# EAGLE design MicroMod-LoRa-1W-Function-Board-Waterfall (EAGLE 9.6.2)
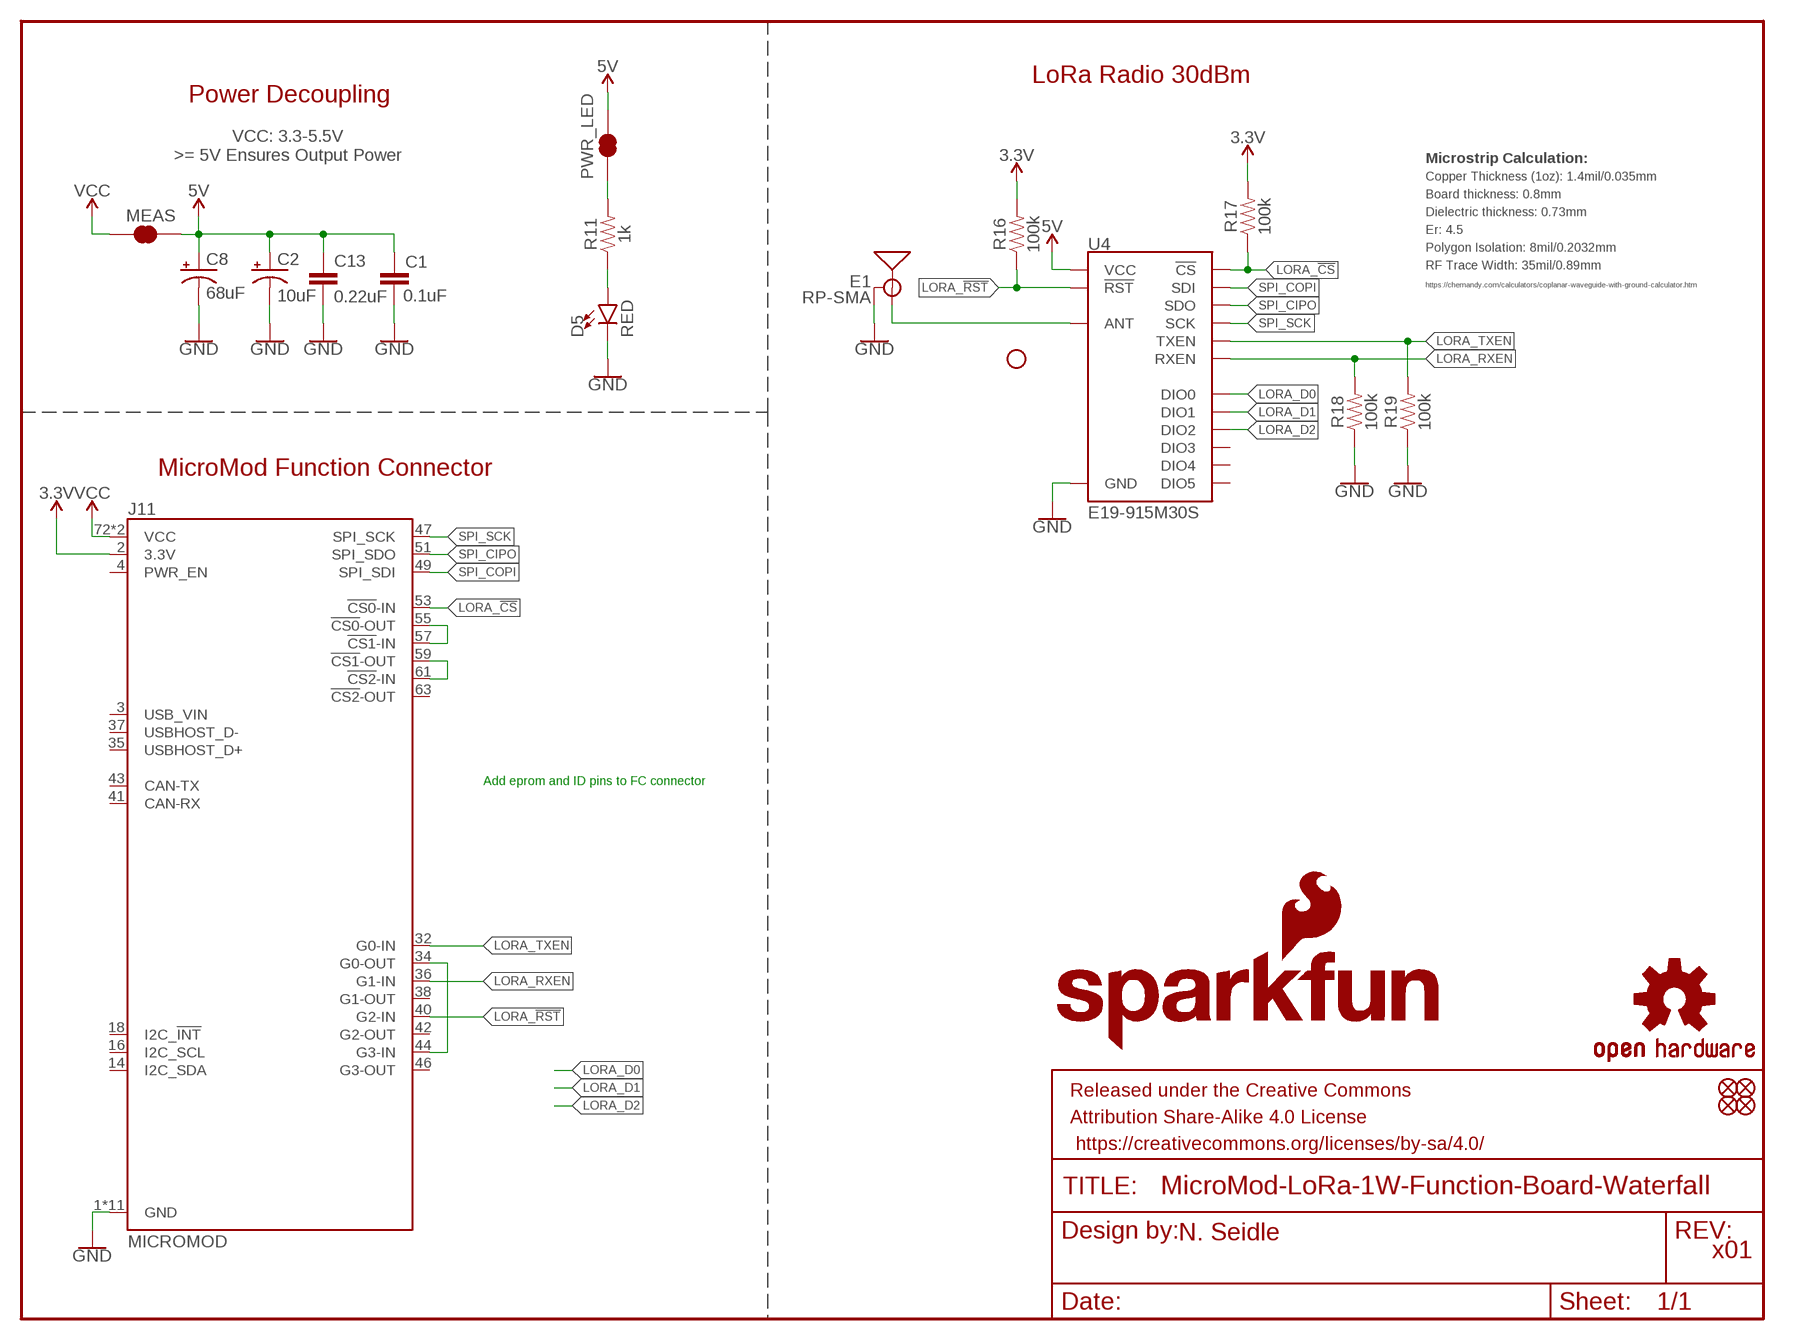
[diagram p0: schematic, sheet 1]

## Parts
C1  0.1uF  0.1UF-0603-25V-(+80/-20%)  [0603]
C2  10uF  10UF-POLAR-EIA3216-16V-10%(TANT)  [EIA3216]
C8  68uF  68UF-POLAR-EIA3528-10V-10%(TANT)  [EIA3528]
C13  0.22uF  0.22UF-0603-25V-10%  [0603]
D5  RED  LED-RED0603  [LED-0603]
E1  RP-SMA  ANTENNA-SMA-GROUNDEDEDGE_RPSMA_SMD  [SMA-EDGE-SMD]
FD1  FIDUCIALUFIDUCIAL  [FIDUCIAL-MICRO]
FD2  FIDUCIALUFIDUCIAL  [FIDUCIAL-MICRO]
FD3  FIDUCIALUFIDUCIAL  [FIDUCIAL-MICRO]
FD4  FIDUCIALUFIDUCIAL  [FIDUCIAL-MICRO]
FRAME2  FRAME-LETTER  [CREATIVE_COMMONS]
H1  STAND-OFF  [STAND-OFF]
J11  MICROMOD  [M.2-CARD-E-22_FUNCTION_STANDARD]
LOGO1  SFE_LOGO_NAME_FLAME.1_INCH  [SFE_LOGO_NAME_FLAME_.1]
LOGO3  OSHW-LOGOMINI  [OSHW-LOGO-MINI]
MEAS  JUMPER-COMBO_2_NC_TRACE  [COMBO-JUMPER_2_NC_TRACE]
PWR_LED  JUMPER-SMT_2_NC_TRACE_SILK  [SMT-JUMPER_2_NC_TRACE_SILK]
R11  1k  1KOHM-0603-1/10W-1%  [0603]
R16  100k  100KOHM-0603-1/10W-1%  [0603]
R17  100k  100KOHM-0603-1/10W-1%  [0603]
R18  100k  100KOHM-0603-1/10W-1%  [0603]
R19  100k  100KOHM-0603-1/10W-1%  [0603]
U4  E19-915M30S  E19-915MS1W  [E19-915MS1W]

## Nets
3.3V: J11.2(3.3V) R16.2 R17.2
5V: C1.1 C2.+ C8.A(+) C13.1 MEAS.2 MEAS.4 PWR_LED.2 U4.11(VCC)
GND: C1.2 C2.- C8.C(-) C13.2 D5.C E1.GND@0(GND) E1.GND@1(GND) J11.1(GND) J11.33(GND) J11.39(GND) J11.45(GND) J11.75(GND) J11.GND1(GND) J11.GND2(GND) J11.GND3(GND) J11.GND4(GND) J11.GND5(GND) J11.GND6(GND) R18.1 R19.1 U4.1(GND) U4.9(GND) U4.10(GND) U4.18(GND) U4.20(GND) U4.21(GND) U4.22(GND)
LORA_!CS!: J11.53(!CS0!-IN) R17.1 U4.15(!CS)
LORA_!RST!: J11.40(G2-IN) R16.1 U4.8(!RST)
LORA_D0: U4.7(DIO0)
LORA_D1: U4.6(DIO1)
LORA_D2: U4.5(DIO2)
LORA_RXEN: J11.36(G1-IN) R18.2 U4.17(RXEN)
LORA_TXEN: J11.32(G0-IN) R19.2 U4.16(TXEN)
N$1: E1.SIG(SIGNAL) U4.19(ANT)
N$2: J11.55(!CS0!-OUT) J11.57(!CS1!-IN)
N$3: J11.59(!CS1!-OUT) J11.61(!CS2!-IN)
N$4: J11.34(G0-OUT) J11.44(G3-IN)
N$5: D5.A R11.1
N$6: PWR_LED.1 R11.2
SPI_CIPO: J11.51(SPI_SDO) U4.13(SDO)
SPI_COPI: J11.49(SPI_SDI) U4.14(SDI)
SPI_SCK: J11.47(SPI_SCK) U4.12(SCK)
VCC: J11.72(VCC) J11.74(VCC) MEAS.1 MEAS.3
Unconnected: J11.3(USB_VIN) J11.4(PWR_EN) J11.14(I2C_SDA) J11.16(I2C_SCL) J11.18(I2C_!INT!) J11.35(USBHOST_D+) J11.37(USBHOST_D-) J11.38(G1-OUT) J11.41(CAN-RX) J11.42(G2-OUT) J11.43(CAN-TX) J11.46(G3-OUT) J11.63(!CS2!-OUT) U4.2(DIO5) U4.3(DIO4) U4.4(DIO3)

## Notes on the sheet
- LoRa Radio 30dBm
- Power Decoupling
- VCC: 3.3-5.5V
  >= 5V Ensures Output Power
- Microstrip Calculation:
- Copper Thickness (1oz): 1.4mil/0.035mm
- Board thickness: 0.8mm
- Dielectric thickness: 0.73mm
- Er: 4.5
- Polygon Isolation: 8mil/0.2032mm
- RF Trace Width: 35mil/0.89mm
- https://chemandy.com/calculators/coplanar-waveguide-with-ground-calculator.htm
- MicroMod Function Connector
- Add eprom and ID pins to FC connector
- N. Seidle
- x01

## Library data of the parts
C1 = SparkFun-Capacitors:0.1UF: 0.1µF ceramic capacitors A capacitor is a passive two-terminal electrical component used to store electrical energy temporarily in an electric field.; PROD_ID: CAP-00810
C2 = SparkFun-Capacitors:10UF-POLAR: 10.0µF polarized capacitors A capacitor is a passive two-terminal electrical component used to store electrical energy temporarily in an electric field.; PROD_ID: CAP-00811
C8 = SparkFun-Capacitors:68UF-POLAR: 68µF polarized capacitors A capacitor is a passive two-terminal electrical component used to store electrical energy temporarily in an electric field.; PROD_ID: CAP-10790
C13 = SparkFun-Capacitors:0.22UF: 0.22µF ceramic capacitors A capacitor is a passive two-terminal electrical component used to store electrical energy temporarily in an electric field.; PROD_ID: CAP-07822
D5 = SparkFun-LED:LED-RED: Red SMD LED Used in manufacturing of most products at SparkFun Packages: 0603 - SMD 0603 package [Product Link] <http://docs.avagotech.com/docs/AV02-0551EN> 0603 SMART - SMD 0603 SMART package ( more efficient and expensive)[Product Link] <http://www.osram-os.com/Graphics/XPic2/00077099_0.pdf> 1206 - SMD1206 package [Product Link] <https://www.sparkfun.com/datasheets/DevTools/LilyPad/Q150OVS4.pdff> SparkFun Products: Pro Mini 328 -5V <https://www.sparkfun.com/products/821> RedBoard <https://www.sparkfun.com/products/12757> IOIO-OTG <https://www.sparkfun.com/products/13613>; PROD_ID: DIO-00819
E1 = SparkFun-RF:ANTENNA-SMA-GROUNDED: SMA Antenna Connector w/ Ground Edge-mount and SMD SMA connectors for RF Antennas. **4-LAYER BOARD WARNING!!** When designing a 4-layer board using any of the SMD variants, you will need to manually add a cutout polygon on any internal power layers to make sure that you don't end up with exposed copper around the edge of the routed hole for these connectors. Exposed power copper could then short to the connector body - and that would be bad. Why hasn't anyone added the cutout polygons directly to the connector footprint? Well, your internal layers (usually 2 and 15) may be covered with GND polygons and you might well want the copper to go all the way to the edge, especially under the connector SIGNAL pin. So adding cutouts to the footprint might make matters worse, not better...; PROD_ID: CONN-15101
FD1-FD4 = SparkFun-Aesthetics:FIDUCIAL: Fiducial Alignment Points Point-of-reference for pick-and-place machines and other optical instruments.
FRAME2 = SparkFun-Aesthetics:FRAME-LETTER: Schematic Frame - Letter Standard 8.5x11 US Letter frame
H1 = SparkFun-Hardware:STAND-OFF: Stand Off Drill holes for mechanically mounting via screws, standoffs, etc. Note: Use the keepout ring to avoid running the screw head into surrounding components. Variant Overviews STAND-OFF - Mechanical footprint for a #4 phillips button head screw. STAND-OFF-TIGHT - Mechanical footprint for a #4 phillips button head screw, Example SparkFun Products Screw - Phillips Head (1/4", 4-40, 10 pack) <https://www.sparkfun.com/products/10453> (PRT-10453) Screw - Phillips Head (1/2", 4-40, 10 pack) <https://www.sparkfun.com/products/10452> (PRT-10452) Screw - Phillips Head (3/4", 4-40, 10 pack) <https://www.sparkfun.com/products/10451> (PRT-10451) Screw - Phillips Head (1", 4-40, 10 pack) <https://www.sparkfun.com/products/10450> (PRT-10450)
J11 = SparkFun-MicroMod-Test:MICROMOD: MicroMod Connector Description: A card edge connector and mating PCB connector to allow various MicroMod Processor Boards to be coupled with various carrier boards of different capabilities. Based on the M.2 standard.
LOGO1 = SparkFun-Aesthetics:SFE_LOGO_NAME_FLAME: SparkFun Font Logo w/ Flame This is the SparkFun full logo. The logo on the schematic will always be the same size; the package variant is the height of the flame part of the logo. Default layer for the logo on the board is tSilk.
LOGO3 = SparkFun-Aesthetics:OSHW-LOGO: Open-Source Hardware (OSHW) Logo This logo indicates the piece of hardware it is found on incorporates a OSHW license and/or adheres to the definition of open source hardware found here: http://freedomdefined.org/OSHW
MEAS = SparkFun-Jumpers:JUMPER-COMBO_2_NC_TRACE
PWR_LED = SparkFun-Jumpers:JUMPER-SMT_2_NC_TRACE: Normally closed trace jumper This jumper has a trace between two pads so it's normally closed (NC). Use a razor knife to open the connection. For best results follow the IPC guidelines for cutting traces: Cutout at least 0.063 mm (0.005 in). Remove all loose material to clean up the cut area. Seal the cut with an approved epoxy. Reapply solder to reclose the connection.
R11 = SparkFun-Resistors:1KOHM: 1kΩ resistor A resistor is a passive two-terminal electrical component that implements electrical resistance as a circuit element. Resistors act to reduce current flow, and, at the same time, act to lower voltage levels within circuits. - Wikipedia; PROD_ID: RES-07856
R16-R19 = SparkFun-Resistors:100KOHM: 100kΩ resistor A resistor is a passive two-terminal electrical component that implements electrical resistance as a circuit element. Resistors act to reduce current flow, and, at the same time, act to lower voltage levels within circuits. - Wikipedia; PROD_ID: RES-07828
U4 = SparkFun-RF:E19-915MS1W: Chengdu Ebyte E19-915M30S - 915M LoRa (FSK) TRX Using SX1276 This is a 915 MHz LoRa (or optionally FSK) modulated transciver bassed on the Semtech SX1276. It has a high ouput power of 1W an a pre-installed U.FL connector. Can be used with LoRa WAN with DIO0, DIO1, and DIO2 hooked up to controller interrupt inputs SparkFun Products: SAMD21 Pro RF 1W <https://www.sparkfun.com/products/15034>; PROD_ID: IC-14076

## Net classes
0 default: width 0 mm, drill 0 mm
1 vcc: width 0 mm

## Board
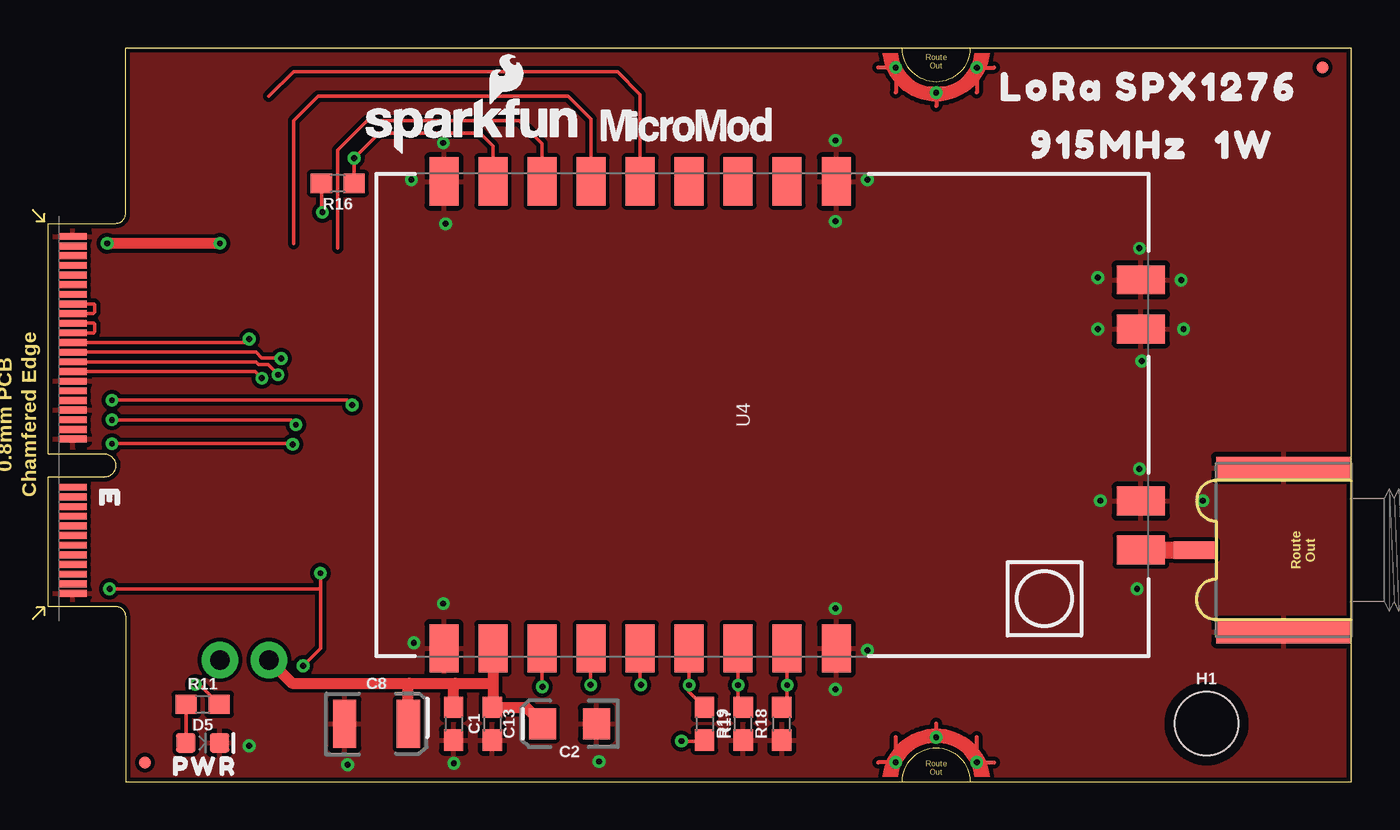
[diagram p1: board, top side]
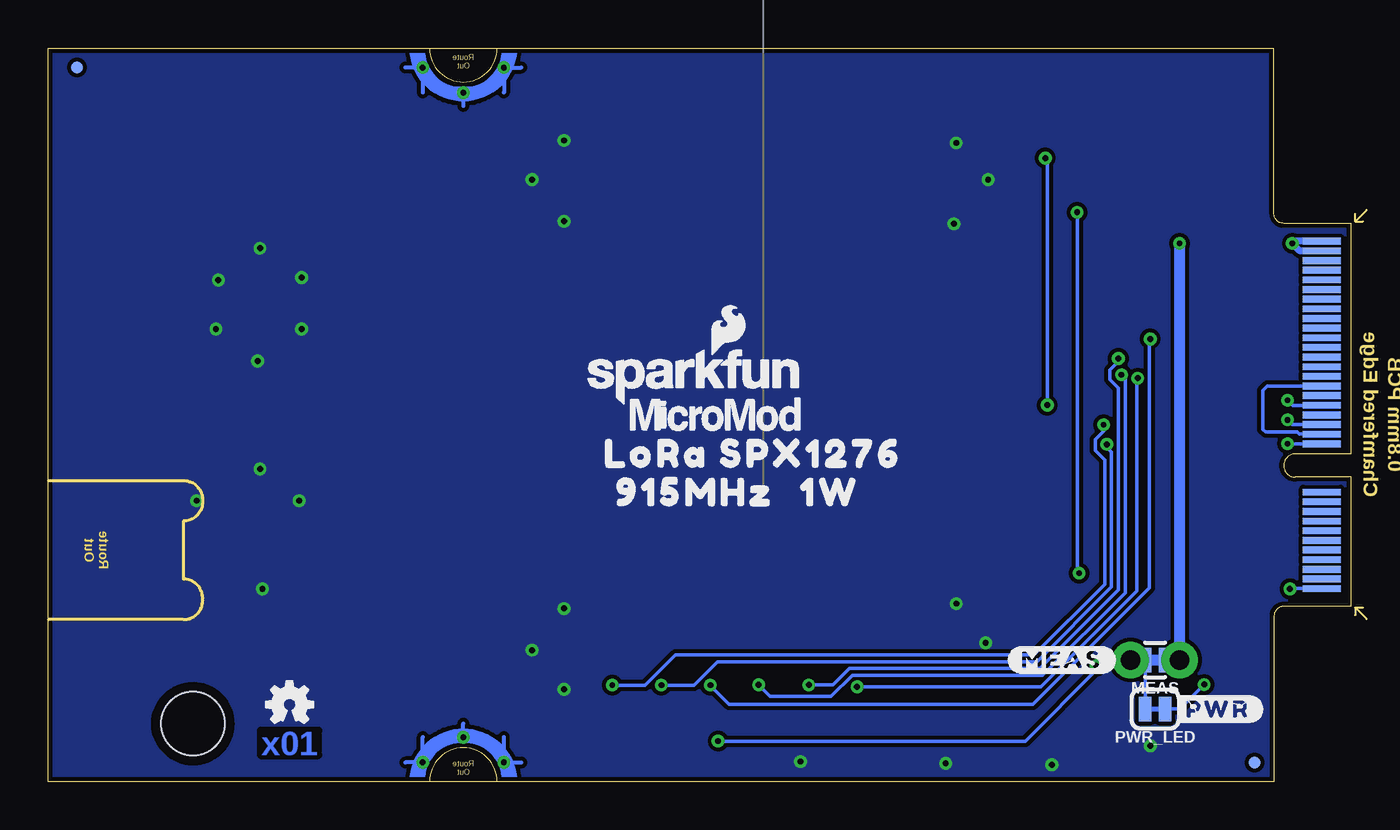
[diagram p2: board, bottom side, seen from below]

Size 67.5 x 38 mm. Coordinates in mm from the lower left corner, seen from the top.
Outline: 0,9.07 0,15.78 2.9,15.78 arc180 2.9,16.98 0,16.98 0,28.93 3.5,28.93 arc90 4,29.4 4,38 67.5,38 67.5,0 4,0 4,8.6 arc90 3.5,9.07 0,9.07
Copper layers (1*16): Top/Horz 0.035mm / dielectric 1.5mm / Bottom/Vert 0.035mm
Design rules "SparkFun-2-layer-TIGHT *": minimum track width 7mil, minimum drill 12mil, track to track 7mil, track to pad 7mil, pad to pad 7mil, via to via 7mil, smd to smd 7mil, copper to edge 7mil, drill to drill 7mil, minimum pad ring 7mil, minimum via ring 7mil, stop-mask expansion 4mil, vias tented up to drill 25mil, thermal gap 10mil

### Footprints (pad centres in the part's own frame; a part is rotated, then mirrored left to right if it is on the bottom)
0603 = smd 1.1 x 1: 1 -0.85,0; 2 0.85,0
EIA3216 = smd 1.4 x 1.6: + 1.4,0; - -1.4,0
EIA3528 = smd 1.2 x 2.5: A 1.65,0; C -1.65,0
LED-0603 = smd 1 x 1: A -0.877,0; C 0.877,0
SMA-EDGE-SMD = smd 1.15 x 7: GND@0 -4.25,-3.5; GND@1 4.25,-3.5 | smd 0.9 x 2.2: SIG 0,-8.1
FIDUCIAL-MICRO = smd 0.635 x 0.635: 1 0,0
STAND-OFF = hole 3.302: 0,0
M.2-CARD-E-22_FUNCTION_STANDARD = smd 0.35 x 1.45: 1 9.25,1.275; 3 8.75,1.275; 5 8.25,1.275; 7 7.75,1.275; 9 7.25,1.275; 11 6.75,1.275; 13 6.25,1.275; 15 5.75,1.275; 17 5.25,1.275; 19 4.75,1.275; 21 4.25,1.275; 23 3.75,1.275; 33 1.25,1.275; 35 0.75,1.275; 37 0.25,1.275; 39 -0.25,1.275; 41 -0.75,1.275; 43 -1.25,1.275; 45 -1.75,1.275; 47 -2.25,1.275; 49 -2.75,1.275; 51 -3.25,1.275; 53 -3.75,1.275; 55 -4.25,1.275; 57 -4.75,1.275; 59 -5.25,1.275; 61 -5.75,1.275; 63 -6.25,1.275; 65 -6.75,1.275; 67 -7.25,1.275; 69 -7.75,1.275; 71 -8.25,1.275; 73 -8.75,1.275; 75 -9.25,1.275 | smd 0.35 x 1.95 bottom: 2 9,1.525; 4 8.5,1.525; 6 8,1.525; 8 7.5,1.525; 10 7,1.525; 12 6.5,1.525; 14 6,1.525; 16 5.5,1.525; 18 5,1.525; 20 4.5,1.525; 22 4,1.525; 32 1.5,1.525; 34 1,1.525; 36 0.5,1.525; 38 0,1.525; 40 -0.5,1.525; 42 -1,1.525; 44 -1.5,1.525; 46 -2,1.525; 48 -2.5,1.525; 50 -3,1.525; 52 -3.5,1.525; 54 -4,1.525; 56 -4.5,1.525; 58 -5,1.525; 60 -5.5,1.525; 62 -6,1.525; 64 -6.5,1.525; 66 -7,1.525; 68 -7.5,1.525; 70 -8,1.525; 72 -8.5,1.525; 74 -9,1.525 | drill 0.305 pad 0.61: GND1 -18,43.9; GND2 -16.7,46; GND3 -18,48.1; GND4 18,43.9; GND5 16.7,46; GND6 18,48.1
COMBO-JUMPER_2_NC_TRACE = smd 0.635 x 1.27: 1 -0.508,0; 2 0.508,0 | drill 1.016 pad 1.88: 3 -1.27,0; 4 1.27,0
SMT-JUMPER_2_NC_TRACE_SILK = smd 0.66 x 1.27: 1 -0.521,0; 2 0.521,0
E19-915MS1W = smd 2.5 x 1.5: 1 12.1,-3.82; 2 12.1,-1.28; 3 12.1,1.26; 4 12.1,3.8; 5 12.1,6.34; 6 12.1,8.88; 7 12.1,11.42; 8 12.1,13.96; 9 12.1,16.5; 10 -12.1,16.5; 11 -12.1,13.96; 12 -12.1,11.42; 13 -12.1,8.88; 14 -12.1,6.34; 15 -12.1,3.8; 16 -12.1,1.26; 17 -12.1,-1.28; 18 -12.1,-3.82 | smd 1.5 x 2.5: 19 -7,-19.6; 20 -4.46,-19.6; 21 4.46,-19.6; 22 7,-19.6

### Placement (x,y rotation side)
C1  21,3 270 top
C2  27,3 180 top
C8  17,3 0 top
C13  23,3 270 top
D5  8,2 0 top
E1  67.5,12 270 top
FD1  5,1 0 top
FD2  66,37 0 top
FD3  5,1 0 bottom
FD4  66,37 0 bottom
FRAME2  7.62,-8.94 0 top  (outside the outline)
H1  60,3 0 top
J11  0,19 270 top
LOGO1  22,34 0 top
LOGO3  55,4 0 bottom
LOGO4  SFE_LOGO_NAME_FLAME.1_INCH  [SFE_LOGO_NAME_FLAME_.1]  34,21 0 bottom
MEAS  10.16,6.3 180 bottom
PWR_LED  10.16,3.76 180 bottom
R11  8,4 0 top
R16  15,31 180 top
R17  34,3 270 top
R18  38,3 90 top
R19  36,3 90 top
U4  37,19 90 top
U$1  [LORA0]  36,17 0 bottom
U$2  [1W1]  62,33 0 top
U$3  [915MHZ2]  55,33 0 top
U$4  [#PWR#0]  9.27,3.76 0 bottom
U$5  [LORA0]  52,36 0 top
U$6  [SPX12763]  60,36 0 top
U$7  [PWR0]  8.1,0.8 0 top
U$27  [SPX12763]  28,17 0 bottom
U$28  [#MEAS#3]  17.78,6.3 0 bottom
U$29  [915MHZ2]  34,15 0 bottom
U$30  [1W1]  27,15 0 bottom
U$37  [MICROMOD_LOGO_.35]  33,19 0 bottom
U$63  [MICROMOD_LOGO_.35]  33,34 0 top

### Tracks (layer width: path | path; a pad name or v marks a point on that pad's centre or on a via)
3.3V  (via drill 0.3)
  Top/Horz 0.178: v32.8,2.1 33.95,2.1 R17.2 | R16.2 14.15,29.55 v14.2,29.5 | v14.1,10.8 14.1,9.98 | 14.1,9.98 14.1,6.9 v13.2,6 | v3.17,9.98 14.1,9.98
  Bottom/Vert 0.178: v32.8,2.1 16.89,2.1 13.2,5.79 v13.2,6 | v14.2,29.5 14.2,10.9 v14.1,10.8 | J11.2 3.16,10 v3.17,9.98
5V
  Top/Horz 0.559: MEAS.4 12.63,5.1 18.7,5.1 | U4.11 23.04,5.1 | 23.04,5.1 23.04,3.89 C13.1 24.75,3.85 C2.+ | 18.7,5.1 21.1,5.1 | 21.1,5.1 23.04,5.1 | C1.1 21,5 21.1,5.1 | C8.A 18.65,5.05 18.7,5.1
  Bottom/Vert 0.178: MEAS.4 MEAS.2 10.67,3.77 PWR_LED.2
GND  (via drill 0.3)
  Top/Horz 0.178: J11.GND5 45.2,2.3 J11.GND4 | J11.GND2 45.2,35.7 J11.GND1
  other vias: 18.81,31.19 20.59,28.91 20.46,33.1 40.78,33.22 42.43,31.19 40.78,29.03 54.37,26.11 56.53,27.64 58.69,25.98 58.82,23.45 56.66,21.79 54.37,23.45 59.82,14.55 56.53,16.21 54.5,14.55 56.4,9.98 40.78,4.78 42.43,6.81 40.78,8.97 20.46,9.22 18.94,7.19 15.51,0.87 21.01,0.95 28.54,1.04 10.41,1.86
  pour Bottom/Vert (isolate 0.203): 0,38 68,38 68,0 0,0
  pour Top/Horz (isolate 0.203): 0,38 68,38 68,0 0,0
LORA_!CS!  (via drill 0.3)
  Top/Horz 0.178: R17.1 33.2,4.65 v33.2,5 U4.15 | v10.41,22.94 10.23,22.75 J11.53
  Bottom/Vert 0.178: v33.2,5 33.2,4.96 32.25,4.01 16.48,4.01 12.18,8.32 12.09,8.4 10.46,10.03 10.46,11 10.46,22.89 v10.41,22.94
LORA_!RST!  (via drill 0.3)
  Top/Horz 0.178: R16.1 v15.85,32.31 17.14,33.61 22.37,33.61 23.04,32.93 U4.8 | v15.75,19.51 15.49,19.76 v3.3,19.76
  Bottom/Vert 0.178: J11.40 3.04,19.5 v3.3,19.76 | v15.75,19.51 15.75,32.21 v15.85,32.31
LORA_D0
  Top/Horz 0.178: U4.7 25.58,33.06 24.4,34.24 16.51,34.24 14.99,32.72 14.99,27.64
LORA_D1
  Top/Horz 0.178: 12.7,27.89 12.7,34.24 13.97,35.51 26.94,35.51 28.12,34.33 U4.6
LORA_D2
  Top/Horz 0.178: 11.43,35.51 12.7,36.78 29.48,36.78 30.66,35.6 U4.5
LORA_RXEN  (via drill 0.3)
  Top/Horz 0.178: R18.2 38.28,4.13 v38.28,5 U4.17 | v3.3,18.75 12.57,18.75 v12.83,18.49
  Bottom/Vert 0.178: v38.28,5 36.58,5 35.01,6.57 16.43,6.57 12.78,10.23 12.78,16.66 13.26,17.15 13.26,17.72 12.83,18.16 v12.83,18.49 | J11.36 3.06,18.5 v3.3,18.75
LORA_TXEN  (via drill 0.3)
  Top/Horz 0.178: R19.2 35.74,4.11 v35.74,5 U4.16 | v3.3,17.51 12.63,17.51 v12.66,17.48
  Bottom/Vert 0.178: v35.74,5 34.04,5 32.83,6.22 16.29,6.22 12.42,10.08 12.42,17.07 12.66,17.31 v12.66,17.48 | J11.32 v3.29,17.5 v3.3,17.51
N$1
  Top/Horz 0.889: U4.19 E1.SIG
N$2
  Top/Horz 0.178: J11.57 2.36,23.75 2.41,23.7 2.41,23.32 2.35,23.25 J11.55
N$3
  Top/Horz 0.178: J11.61 2.38,24.75 2.41,24.71 2.41,24.33 2.33,24.25 J11.59
N$4
  Bottom/Vert 0.178: J11.44 4.34,20.5 4.57,20.27 4.57,18.24 4.44,18.11 2.8,18.11 2.7,18 J11.34
N$5
  Top/Horz 0.178: R11.1 7.15,2.03 D5.A
N$6  (via drill 0.3)
  Top/Horz 0.178: R11.2 7.82,5.03 v7.62,5.03
  Bottom/Vert 0.178: v7.62,5.03 8.89,3.76 PWR_LED.1
SPI_CIPO  (via drill 0.3)
  Top/Horz 0.178: v28.1,5.01 28.1,6.88 U4.13 | v12.06,21.92 12.03,21.96 11.06,21.96 10.77,22.25 J11.51
  Bottom/Vert 0.178: v28.1,5.01 26.85,5.01 26,5.86 16.14,5.86 12.06,9.94 12.06,20.4 12.5,20.84 12.5,21.33 12.06,21.76 v12.06,21.92
SPI_COPI  (via drill 0.3)
  Top/Horz 0.178: v30.7,5.01 30.66,5.05 U4.14 | J11.49 10.76,21.75 10.91,21.6 11.38,21.6 v11.9,21.08
  Bottom/Vert 0.178: v30.7,5.01 30.1,4.41 26.94,4.41 25.85,5.51 15.99,5.51 11.71,9.79 11.71,20.89 v11.9,21.08
SPI_SCK  (via drill 0.3)
  Top/Horz 0.178: v25.6,4.91 25.58,4.93 U4.12 | v11.06,20.91 10.72,21.25 J11.47
  Bottom/Vert 0.178: v25.6,4.91 16.09,4.91 11.1,9.89 11.1,20.87 v11.06,20.91
VCC  (via drill 0.3)
  Top/Horz 0.559: v8.89,27.89 v3.05,27.89
  Bottom/Vert 0.178: MEAS.1 MEAS.3
  Bottom/Vert 0.356: J11.74 2.94,28 v3.05,27.89 2.66,27.5 J11.72
  Bottom/Vert 0.559: MEAS.3 v8.89,27.89

### Text on the board
Top/Horz: put vias in gnd area on sma | add i2c eeprom
Bottom/Vert: x01
tDocu: N. Seidle